# EAGLE schematic Servo (EAGLE 8.3.2)
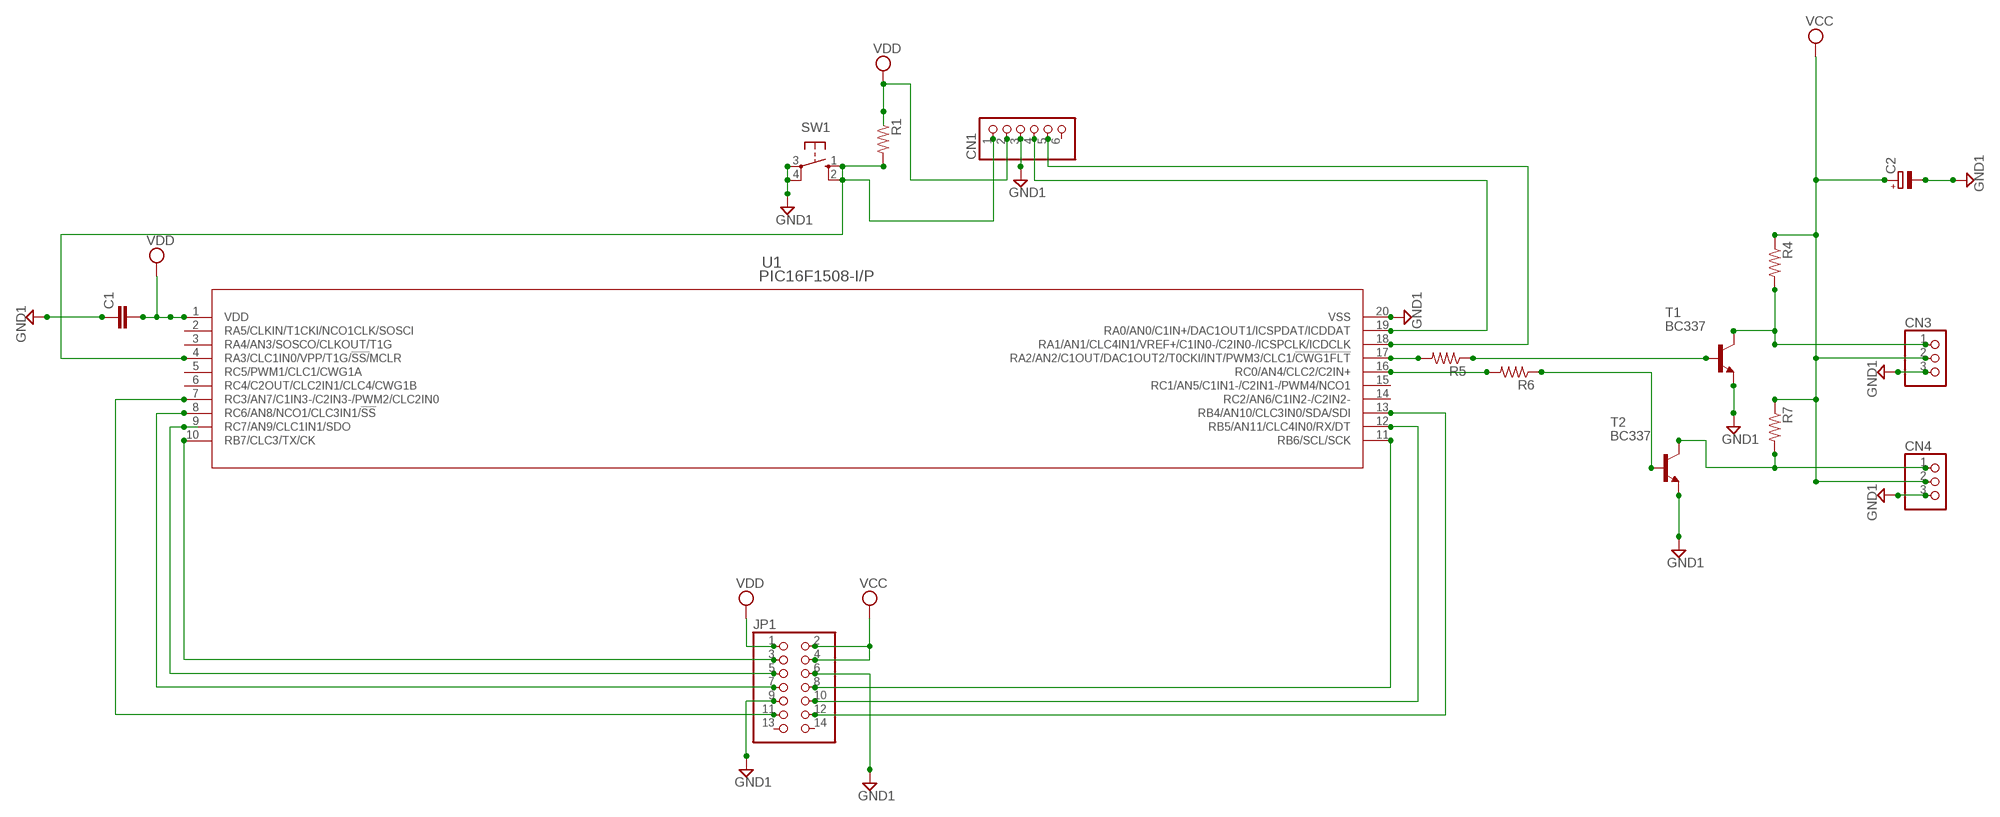
[diagram p0: schematic, sheet 1]

## Parts
C1  C-EU025-025X050  [C025-025X050]
C2  CPOL-EUA  [PANASONIC_A]
CN1  PINHD-1X6  [1X06]
CN3  PINHD-1X3  [1X03]
CN4  PINHD-1X3  [1X03]
JP1  PINHD-2X7  [2X07]
R1  R-US_R0603  [R0603]
R4  R-US_R0603  [R0603]
R5  R-US_R0603  [R0603]
R6  R-US_R0603  [R0603]
R7  R-US_R0603  [R0603]
SW1  10-XX  [B3F-10XX]
T1  BC337  [TO92]
T2  BC337  [TO92]
U1  PIC16F1508-I/P  [PDIP20_300MC]

## Nets
GND1: C1.1 C2.- CN1.3 CN3.3 CN4.3 JP1.6 JP1.9 SW1.3(P) SW1.4(P1) T1.1(E) T2.1(E) U1.20(VSS)
N$1: JP1.3 U1.10(RB7/CLC3/TX/CK)
N$2: JP1.5 U1.9(RC7/AN9/CLC1IN1/SDO)
N$3: JP1.7 U1.8(RC6/AN8/NCO1/CLC3IN1/!SS)
N$4: CN4.1 R7.2 T2.3(C)
N$5: JP1.11 U1.7(RC3/AN7/C1IN3-/C2IN3-/PWM2/CLC2IN0)
N$8: CN1.1 R1.2 SW1.1(S) SW1.2(S1) U1.4(RA3/CLC1IN0/VPP/T1G/!SS/!MCLR)
N$9: JP1.8 U1.11(RB6/SCL/SCK)
N$10: JP1.10 U1.12(RB5/AN11/CLC4IN0/RX/DT)
N$11: JP1.12 U1.13(RB4/AN10/CLC3IN0/SDA/SDI)
N$15: R5.2 U1.17(RA2/AN2/C1OUT/DAC1OUT2/T0CKI/INT/PWM3/CLC1/!CWG1FLT)
N$16: R6.2 U1.16(RC0/AN4/CLC2/C2IN+)
N$17: R5.1 T1.2(B)
N$18: R6.1 T2.2(B)
N$19: CN1.5 U1.18(RA1/AN1/CLC4IN1/VREF+/C1IN0-/C2IN0-/ICSPCLK/ICDCLK)
N$20: CN1.4 U1.19(RA0/AN0/C1IN+/DAC1OUT1/ICSPDAT/ICDDAT)
N$24: CN3.1 R4.2 T1.3(C)
VCC: C2.+ CN3.2 CN4.2 JP1.2 JP1.4 R4.1 R7.1
VDD: C1.2 CN1.2 JP1.1 R1.1 U1.1(VDD)
Unconnected: CN1.6 JP1.13 JP1.14 U1.2(RA5/CLKIN/T1CKI/NCO1CLK/SOSCI) U1.3(RA4/AN3/SOSCO/CLKOUT/T1G) U1.5(RC5/PWM1/CLC1/CWG1A) U1.6(RC4/C2OUT/CLC2IN1/CLC4/CWG1B) U1.14(RC2/AN6/C1IN2-/C2IN2-) U1.15(RC1/AN5/C1IN1-/C2IN1-/PWM4/NCO1)

## Library data of the parts
C1 = rcl:C-EU: CAPACITOR, European symbol
C2 = rcl:CPOL-EU: POLARIZED CAPACITOR, European symbol
CN1 = pinhead:PINHD-1X6: PIN HEADER
CN3 CN4 = pinhead:PINHD-1X3: PIN HEADER
JP1 = pinhead:PINHD-2X7: PIN HEADER
R1 R4-R7 = rcl:R-US_: RESISTOR, American symbol
SW1 = switch-omron:10-XX: OMRON SWITCH; MPN: B3F-1000; OC_FARNELL: 176432; OC_NEWARK: 36M3542
T1 T2 = transistor:BC337: NPN TRANSISTOR
U1 = pic16f1508:PIC16F1508-I/P; MANUFACTURER_PART_NUMBER: pic16f1508ip; VENDOR: Microchip